# Altium project PCB_Project1.PrjPCB
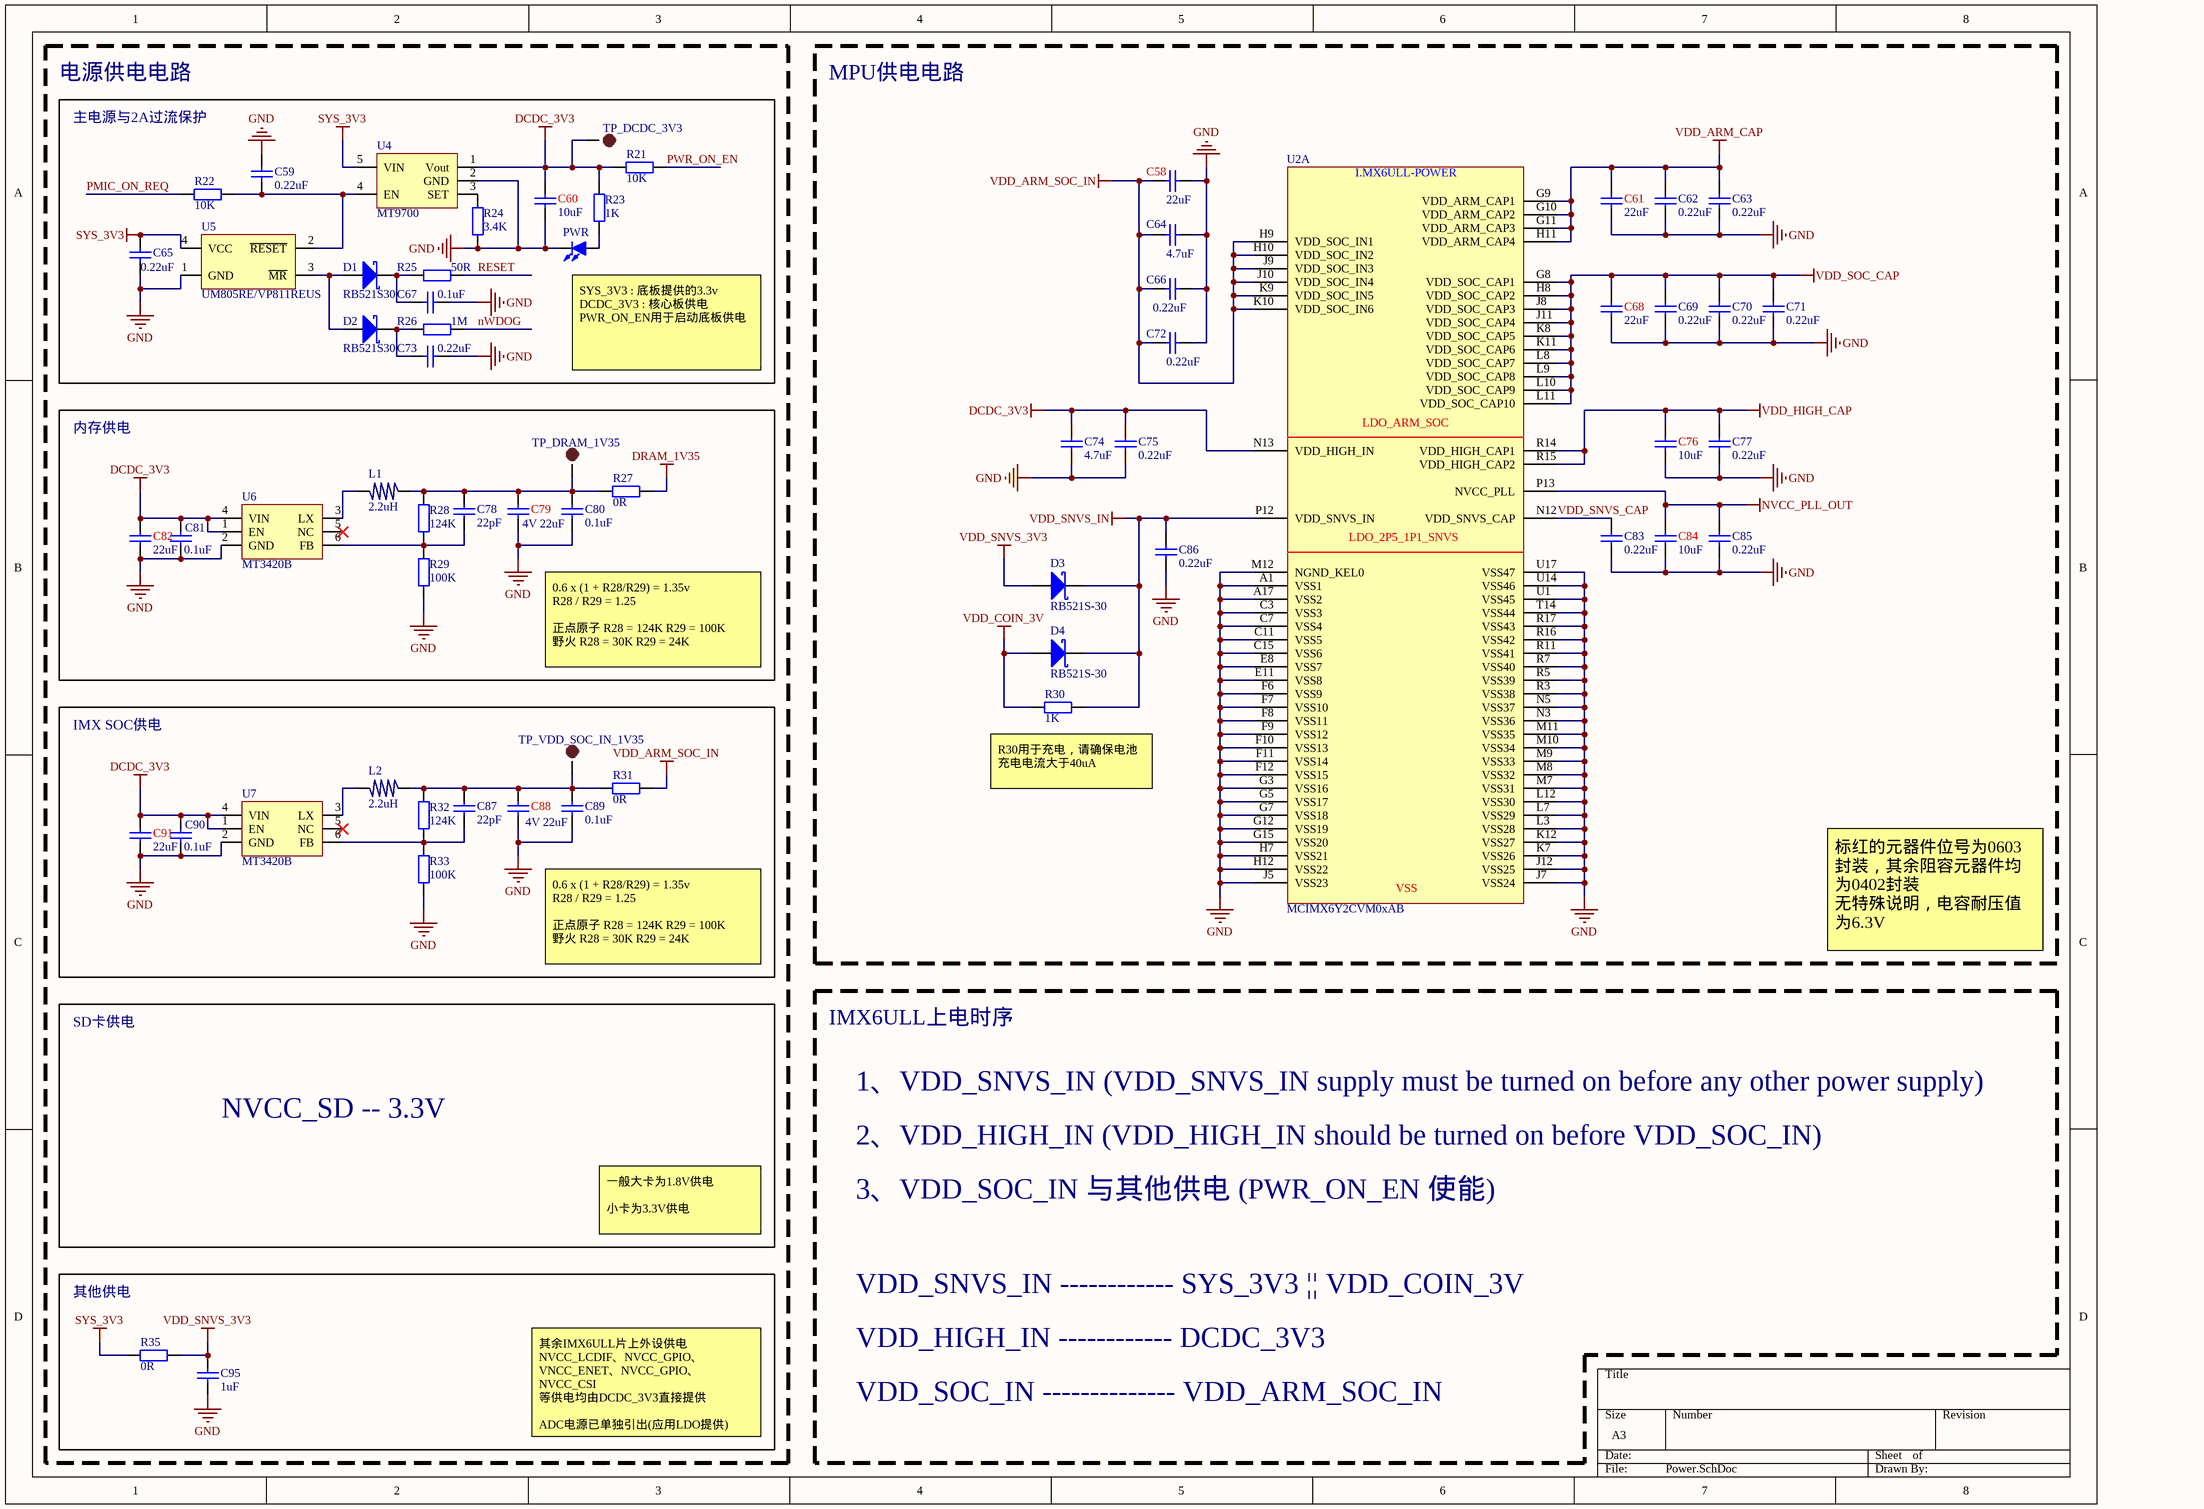
[diagram p0: Power.SchDoc]
5 sheets, 151 parts. Net scope: global (net labels, ports and power ports of the same name join across sheets).
Board file: Linux_Core_Board.PcbDoc
Sheets:
  Power.SchDoc
  Imx6ull.SchDoc
  DDR.SchDoc
  Connector.SchDoc
  eMMC.SchDoc

## Sheet Power.SchDoc
size A3; SheetNumber: 1; SheetTotal: 4

### Parts
C58  22uF  [0603_C _MINI]
C59  0.22uF  [0402_C]
C60  10uF  [0603_C _MINI]
C61  22uF  [0603_C _MINI]
C62  0.22uF  [0402_C]
C63  0.22uF  [0402_C]
C64  4.7uF  [0402_C]
C65  0.22uF  [0402_C]
C66  0.22uF  [0402_C]
C67  0.1uF  [0402_C]
C68  22uF  [0603_C _MINI]
C69  0.22uF  [0402_C]
C70  0.22uF  [0402_C]
C71  0.22uF  [0402_C]
C72  0.22uF  [0402_C]
C73  0.22uF  [0402_C]
C74  4.7uF  [0402_C]
C75  0.22uF  [0402_C]
C76  10uF  [0603_C _MINI]
C77  0.22uF  [0402_C]
C78  22pF  [0402_C]
C79  4V 22uF  [0603_C _MINI]
C80  0.1uF  [0402_C]
C81  0.1uF  [0402_C]
C82  22uF  [0603_C _MINI]
C83  0.22uF  [0402_C]
C84  10uF  [0603_C _MINI]
C85  0.22uF  [0402_C]
C86  0.22uF  [0402_C]
C87  22pF  [0402_C]
C88  4V 22uF  [0603_C _MINI]
C89  0.1uF  [0402_C]
C90  0.1uF  [0402_C]
C91  22uF  [0603_C _MINI]
C95  1uF  [0402_C]
D1  RB521S30  [SOD-523]
D2  RB521S30  [SOD-523]
D3  RB521S-30  [SOD-523]
D4  RB521S-30  [SOD-523]
L1  2.2uH  [NR3015]
L2  2.2uH  [NR3015]
PWR  (no value)  [LED 0603B]
R21  10K  [0402_R]
R22  10K  [0402_R]
R23  1K  [0402_R]
R24  3.4K  [0402_R]
R25  50R  [0402_R]
R26  1M  [0402_R]
R27  0R  [0402_R]
R28  124K  [0402_R]
R29  100K  [0402_R]
R30  1K  [0402_R]
R31  0R  [0402_R]
R32  124K  [0402_R]
R33  100K  [0402_R]
R35  0R  [0402_R]
TP_DCDC_3V3  SOC_IN  [TP-1.0]  (value not drawn)
TP_DRAM_1V35  SOC_IN  [TP-1.0]  (value not drawn)
TP_VDD_SOC_IN_1V35  SOC_IN  [TP-1.0]  (value not drawn)
U2  MCIMX6Y2CVM0xAB  [BGA289_17x17_0.8Pitch]  (part A of 5)
U4  MT9700  [SOT23-5L]
U5  UM805RE/VP811REUS  [SOT143]
U6  MT3420B  [SOT23-6L]
U7  MT3420B  [SOT23-6L]

### Blocks framed on the sheet
MPU供电电路: C58 C61-C64 C66 C68-C72 C74-C77 C83-C86 D3 D4 R30 U2
电源供电电路: C59 C60 C65 C67 C73 D1 D2 PWR R21-R26 TP_DCDC_3V3 U4 U5
内存供电: C78-C82 L1 R27-R29 TP_DRAM_1V35 U6
IMX SOC供电: C87-C91 L2 R31-R33 TP_VDD_SOC_IN_1V35 U7
其他供电: C95 R35

### Nets
DCDC_3V3: C60.2 C74.2 C75.2 C81.2 C82.2 C90.2 C91.2 R21.1 R23.2 TP_DCDC_3V3.1 U2.N13(VDD_HIGH_IN) U4.1(Vout) U6.1(EN) U6.4(VIN) U7.1(EN) U7.4(VIN)
DRAM_1V35: R27.2
GND: C58.2 C59.2 C60.1 C61.1 C62.1 C63.1 C64.2 C65.1 C66.2 C67.2 C68.1 C69.1 C70.1 C71.1 C72.2 C73.2 C74.1 C75.1 C76.1 C77.1 C79.1 C80.1 C81.1 C82.1 C83.1 C84.1 C85.1 C86.1 C88.1 C89.1 C90.1 C91.1 C95.1 PWR.2(K) R24.2 R29.1 R33.1 U2.A1(VSS1) U2.A17(VSS2) U2.C3(VSS3) U2.C7(VSS4) U2.C11(VSS5) U2.C15(VSS6) U2.E8(VSS7) U2.E11(VSS8) U2.F6(VSS9) U2.F7(VSS10) U2.F8(VSS11) U2.F9(VSS12) U2.F10(VSS13) U2.F11(VSS14) U2.F12(VSS15) U2.G3(VSS16) U2.G5(VSS17) U2.G7(VSS18) U2.G12(VSS19) U2.G15(VSS20) U2.H7(VSS21) U2.H12(VSS22) U2.J5(VSS23) U2.J7(VSS24) U2.J12(VSS25) U2.K7(VSS26) U2.K12(VSS27) U2.L3(VSS28) U2.L7(VSS29) U2.L12(VSS30) U2.M7(VSS31) U2.M8(VSS32) U2.M9(VSS33) U2.M10(VSS34) U2.M11(VSS35) U2.M12(NGND_KEL0) U2.N3(VSS36) U2.N5(VSS37) U2.R3(VSS38) U2.R5(VSS39) U2.R7(VSS40) U2.R11(VSS41) U2.R16(VSS42) U2.R17(VSS43) U2.T14(VSS44) U2.U1(VSS45) U2.U14(VSS46) U2.U17(VSS47) U4.2(GND) U5.1(GND) U6.2(GND) U7.2(GND)
NVCC_PLL_OUT: C84.2 C85.2 U2.P13(NVCC_PLL)
SYS_3V3: C65.2 R35.1 U4.5(VIN) U5.4(VCC)
VDD_ARM_CAP: C61.2 C62.2 C63.2 U2.G9(VDD_ARM_CAP1) U2.G10(VDD_ARM_CAP2) U2.G11(VDD_ARM_CAP3) U2.H11(VDD_ARM_CAP4)
VDD_ARM_SOC_IN: C58.1 C64.1 C66.1 C72.1 R31.2 U2.H9(VDD_SOC_IN1) U2.H10(VDD_SOC_IN2) U2.J9(VDD_SOC_IN3) U2.J10(VDD_SOC_IN4) U2.K9(VDD_SOC_IN5) U2.K10(VDD_SOC_IN6)
VDD_COIN_3V: D4.1(A) R30.1
VDD_HIGH_CAP: C76.2 C77.2 U2.R14(VDD_HIGH_CAP1) U2.R15(VDD_HIGH_CAP2)
VDD_SNVS_3V3: C95.2 D3.1(A) R35.2
VDD_SNVS_IN: C86.2 D3.2(C) D4.2(C) R30.2 U2.P12(VDD_SNVS_IN)
VDD_SOC_CAP: C68.2 C69.2 C70.2 C71.2 U2.G8(VDD_SOC_CAP1) U2.H8(VDD_SOC_CAP2) U2.J8(VDD_SOC_CAP3) U2.J11(VDD_SOC_CAP4) U2.K8(VDD_SOC_CAP5) U2.K11(VDD_SOC_CAP6) U2.L8(VDD_SOC_CAP7) U2.L9(VDD_SOC_CAP8) U2.L10(VDD_SOC_CAP9) U2.L11(VDD_SOC_CAP10)
nWDOG: R26.2
PMIC_ON_REQ: R22.1
PWR_ON_EN: R21.2
RESET: R25.2
VDD_SNVS_CAP: C83.2 U2.N12(VDD_SNVS_CAP)
NetC59_1: C59.1 R22.2 U4.4(EN) U5.2(~{RESET})
NetC67_1: C67.1 D1.2(C) R25.1
NetC73_1: C73.1 D2.2(C) R26.1
NetC78_1: C78.1 R28.1 R29.2 U6.6(FB)
NetC78_2: C78.2 C79.2 C80.2 L1.1 R27.1 R28.2 TP_DRAM_1V35.1
NetC87_1: C87.1 R32.1 R33.2 U7.6(FB)
NetC87_2: C87.2 C88.2 C89.2 L2.1 R31.1 R32.2 TP_VDD_SOC_IN_1V35.1
NetD1_1: D1.1(A) D2.1(A) U5.3(~{MR})
NetL1_2: L1.2 U6.3(LX)
NetL2_2: L2.2 U7.3(LX)
NetPWR_1: PWR.1(A) R23.1
NetR24_1: R24.1 U4.3(SET)

Not connected (* = marked no-connect by the designer): U6 5(NC)*; U7 5(NC)*

### Notes on the sheet
- 主电源与2A过流保护
- (near PWR) SYS_3V3 : 底板提供的3.3v
  DCDC_3V3 : 核心板供电
  PWR_ON_EN用于启动底板供电
- 0.6 x (1 + R28/R29) = 1.35v
  R28 / R29 = 1.25
  正点原子 R28 = 124K R29 = 100K
  野火 R28 = 30K R29 = 24K
- (near R30) R30用于充电，请确保电池充电电流大于40uA
- 标红的元器件位号为0603封装，其余阻容元器件均为0402封装
  无特殊说明，电容耐压值为6.3V
- SD卡供电
- IMX6ULL上电时序
- NVCC_SD -- 3.3V
- 1、VDD_SNVS_IN (VDD_SNVS_IN supply must be turned on before any other power supply)
- 2、VDD_HIGH_IN (VDD_HIGH_IN should be turned on before VDD_SOC_IN)
- 一般大卡为1.8V供电
  小卡为3.3V供电
- 3、VDD_SOC_IN 与其他供电 (PWR_ON_EN 使能)
- VDD_SNVS_IN ------------ SYS_3V3 || VDD_COIN_3V
- VDD_HIGH_IN ------------ DCDC_3V3
- 其余IMX6ULL片上外设供电
  NVCC_LCDIF、NVCC_GPIO、
  VNCC_ENET、NVCC_GPIO、
  NVCC_CSI
  等供电均由DCDC_3V3直接提供
  ADC电源已单独引出(应用LDO提供)
- VDD_SOC_IN -------------- VDD_ARM_SOC_IN
- (in symbol MCIMX6Y2CVM0xAB, part A) I.MX6ULL-POWER; LDO_ARM_SOC; LDO_2P5_1P1_SNVS; VSS

### Library data of the parts
C58 C60 C61 C68 C76 C79 C82 C84 C88 C91 = 0603_C_MINI: 贴片电容; ComponentLink1Description: 供应商链接; ComponentLink1URL: http://www.szlcsc.com/product/details_2037.html; Package: 0603; Supplier: LC; SuppliersPartNumber: C1685
C59 C62-C67 C69-C75 C77 C78 C80 C81 C83 C85-C87 C89 C90 C95 = 0402_C: 贴片电容; ComponentLink1Description: 供应商链接; ComponentLink1URL: http://www.szlcsc.com/product/details_1928.html; Package: 0402; Supplier: LC; SuppliersPartNumber: C1576
D3 D4 = RB521S30
L1 L2 = L
PWR = 0603_LED_B: 贴片LED; 版权归属: 源创客; BOM名称: 贴片LED; 学习资源: www.ooocke.com
R21-R33 R35 = 0402_R: 贴片电阻; ComponentLink1Description: 供应商链接; ComponentLink1URL: http://www.szlcsc.com/product/details_26667.html; Package: 0402; Supplier: LC; SuppliersPartNumber: C25924
TP_DCDC_3V3 TP_DRAM_1V35 TP_VDD_SOC_IN_1V35 = TEST-POINT: 测试点
U4 = MT9700: 负载开关
U5 = UM805RE/VP811REUS: 复位芯片
U6 U7 = MT3420B: DCDC

## Sheet Imx6ull.SchDoc
size 299 x 312 mm; SheetNumber: 3; SheetTotal: 4
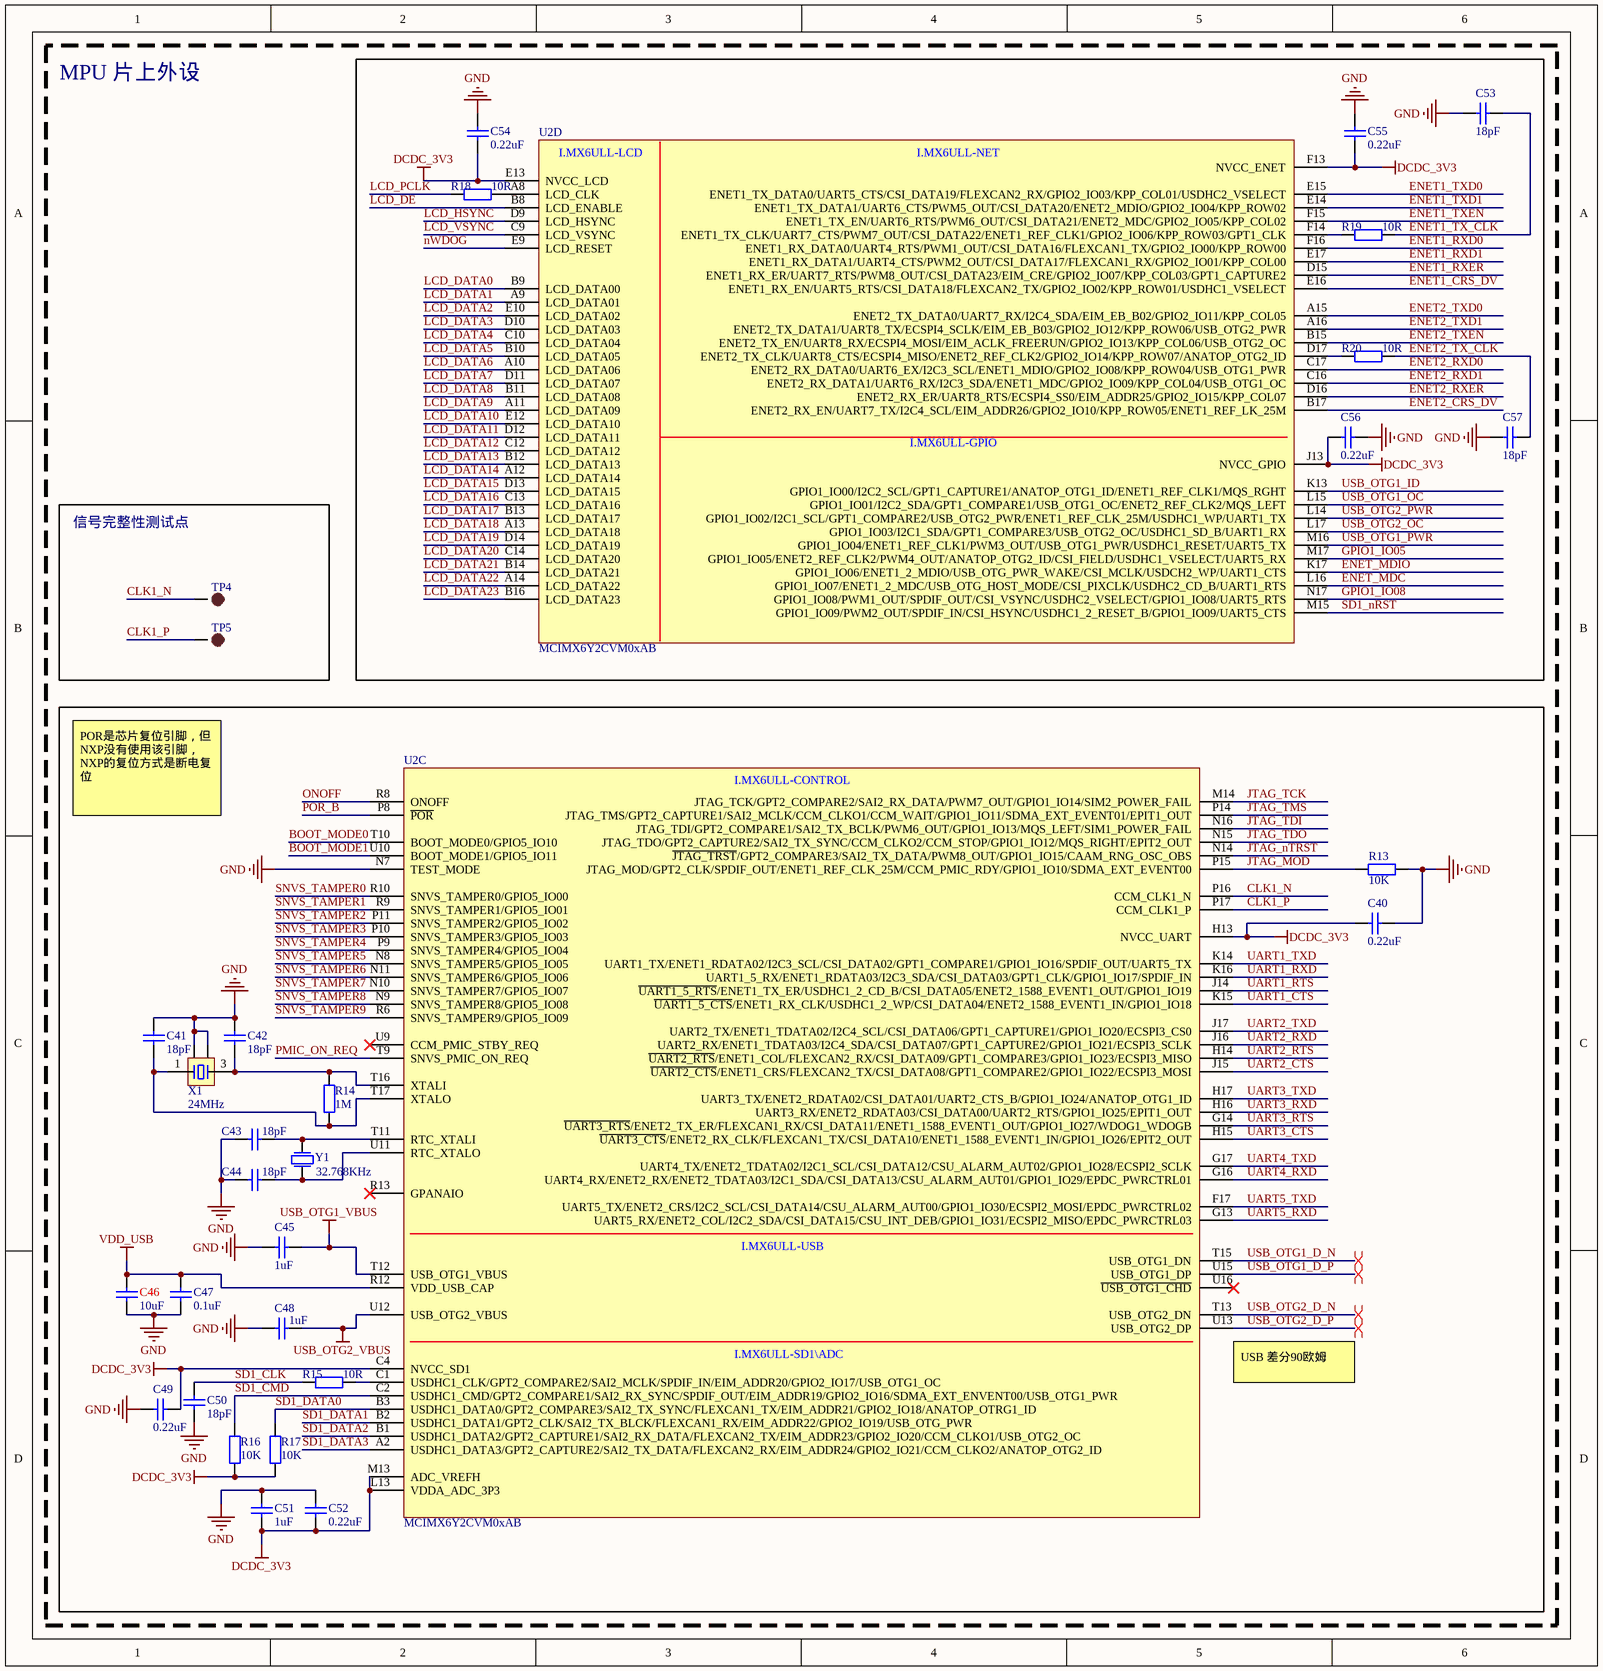
[diagram p1: Imx6ull.SchDoc]

### Parts
C40  0.22uF  [0402_C]
C41  18pF  [0402_C]
C42  18pF  [0402_C]
C43  18pF  [0402_C]
C44  18pF  [0402_C]
C45  1uF  [0402_C]
C46  10uF  [0603_C _MINI]
C47  0.1uF  [0402_C]
C48  1uF  [0402_C]
C49  0.22uF  [0402_C]
C50  18pF  [0402_C]
C51  1uF  [0402_C]
C52  0.22uF  [0402_C]
C53  18pF  [0402_C]
C54  0.22uF  [0402_C]
C55  0.22uF  [0402_C]
C56  0.22uF  [0402_C]
C57  18pF  [0402_C]
R13  10K  [0402_R]
R14  1M  [0402_R]
R15  10R  [0402_R]
R16  10K  [0402_R]
R17  10K  [0402_R]
R18  10R  [0402_R]
R19  10R  [0402_R]
R20  10R  [0402_R]
TP4  SOC_IN  [TP-1.0]  (value not drawn)
TP5  SOC_IN  [TP-1.0]  (value not drawn)
U2  MCIMX6Y2CVM0xAB  [BGA289_17x17_0.8Pitch]  (parts C,D of 5)
X1  24MHz  [OSC 3225-4P]
Y1  32.768KHz  [OSC 3215-2P]

### Blocks framed on the sheet
信号完整性测试点: TP4 TP5

### Nets
DCDC_3V3: C40.1 C49.2 C51.1 C52.1 C54.1 C55.1 C56.1 R16.1 R17.1 U2.C4(NVCC_SD1) U2.E13(NVCC_LCD) U2.F13(NVCC_ENET) U2.H13(NVCC_UART) U2.J13(NVCC_GPIO) U2.L13(VDDA_ADC_3P3) U2.M13(ADC_VREFH)
GND: C40.2 C41.2 C42.2 C43.1 C44.1 C45.1 C46.1 C47.1 C48.1 C49.1 C50.1 C51.2 C52.2 C53.2 C54.2 C55.2 C56.2 C57.1 R13.2 U2.N7(TEST_MODE) X1.2 X1.4
USB_OTG1_VBUS: C45.2 U2.T12(USB_OTG1_VBUS)
USB_OTG2_VBUS: C48.2 U2.U12(USB_OTG2_VBUS)
VDD_USB: C46.2 C47.2 U2.R12(VDD_USB_CAP)
BOOT_MODE0: U2.T10(BOOT_MODE0/GPIO5_IO10)
BOOT_MODE1: U2.U10(BOOT_MODE1/GPIO5_IO11)
CLK1_N: TP4.1 U2.P16(CCM_CLK1_N)
CLK1_P: TP5.1 U2.P17(CCM_CLK1_P)
ENET1_CRS_DV: U2.E16(ENET1_RX_EN/UART5_RTS/CSI_DATA18/FLEXCAN2_TX/GPIO2_IO02/KPP_ROW01/USDHC1_VSELECT)
ENET1_RXD0: U2.F16(ENET1_RX_DATA0/UART4_RTS/PWM1_OUT/CSI_DATA16/FLEXCAN1_TX/GPIO2_IO00/KPP_ROW00)
ENET1_RXD1: U2.E17(ENET1_RX_DATA1/UART4_CTS/PWM2_OUT/CSI_DATA17/FLEXCAN1_RX/GPIO2_IO01/KPP_COL00)
ENET1_RXER: U2.D15(ENET1_RX_ER/UART7_RTS/PWM8_OUT/CSI_DATA23/EIM_CRE/GPIO2_IO07/KPP_COL03/GPT1_CAPTURE2)
ENET1_TX_CLK: C53.1 R19.2
ENET1_TXD0: U2.E15(ENET1_TX_DATA0/UART5_CTS/CSI_DATA19/FLEXCAN2_RX/GPIO2_IO03/KPP_COL01/USDHC2_VSELECT)
ENET1_TXD1: U2.E14(ENET1_TX_DATA1/UART6_CTS/PWM5_OUT/CSI_DATA20/ENET2_MDIO/GPIO2_IO04/KPP_ROW02)
ENET1_TXEN: U2.F15(ENET1_TX_EN/UART6_RTS/PWM6_OUT/CSI_DATA21/ENET2_MDC/GPIO2_IO05/KPP_COL02)
ENET2_CRS_DV: U2.B17(ENET2_RX_EN/UART7_TX/I2C4_SCL/EIM_ADDR26/GPIO2_IO10/KPP_ROW05/ENET1_REF_LK_25M)
ENET2_RXD0: U2.C17(ENET2_RX_DATA0/UART6_EX/I2C3_SCL/ENET1_MDIO/GPIO2_IO08/KPP_ROW04/USB_OTG1_PWR)
ENET2_RXD1: U2.C16(ENET2_RX_DATA1/UART6_RX/I2C3_SDA/ENET1_MDC/GPIO2_IO09/KPP_COL04/USB_OTG1_OC)
ENET2_RXER: U2.D16(ENET2_RX_ER/UART8_RTS/ECSPI4_SS0/EIM_ADDR25/GPIO2_IO15/KPP_COL07)
ENET2_TX_CLK: C57.2 R20.2
ENET2_TXD0: U2.A15(ENET2_TX_DATA0/UART7_RX/I2C4_SDA/EIM_EB_B02/GPIO2_IO11/KPP_COL05)
ENET2_TXD1: U2.A16(ENET2_TX_DATA1/UART8_TX/ECSPI4_SCLK/EIM_EB_B03/GPIO2_IO12/KPP_ROW06/USB_OTG2_PWR)
ENET2_TXEN: U2.B15(ENET2_TX_EN/UART8_RX/ECSPI4_MOSI/EIM_ACLK_FREERUN/GPIO2_IO13/KPP_COL06/USB_OTG2_OC)
ENET_MDC: U2.L16(GPIO1_IO07/ENET1_2_MDC/USB_OTG_HOST_MODE/CSI_PIXCLK/USDHC2_CD_B/UART1_RTS)
ENET_MDIO: U2.K17(GPIO1_IO06/ENET1_2_MDIO/USB_OTG_PWR_WAKE/CSI_MCLK/USDCH2_WP/UART1_CTS)
GPIO1_IO05: U2.M17(GPIO1_IO05/ENET2_REF_CLK2/PWM4_OUT/ANATOP_OTG2_ID/CSI_FIELD/USDHC1_VSELECT/UART5_RX)
GPIO1_IO08: U2.N17(GPIO1_IO08/PWM1_OUT/SPDIF_OUT/CSI_VSYNC/USDHC2_VSELECT/GPIO1_IO08/UART5_RTS)
JTAG_MOD: R13.1 U2.P15(JTAG_MOD/GPT2_CLK/SPDIF_OUT/ENET1_REF_CLK_25M/CCM_PMIC_RDY/GPIO1_IO10/SDMA_EXT_EVENT00)
JTAG_nTRST: U2.N14(~{JTAG_TRST}/GPT2_COMPARE3/SAI2_TX_DATA/PWM8_OUT/GPIO1_IO15/CAAM_RNG_OSC_OBS)
JTAG_TCK: U2.M14(JTAG_TCK/GPT2_COMPARE2/SAI2_RX_DATA/PWM7_OUT/GPIO1_IO14/SIM2_POWER_FAIL)
JTAG_TDI: U2.N16(JTAG_TDI/GPT2_COMPARE1/SAI2_TX_BCLK/PWM6_OUT/GPIO1_IO13/MQS_LEFT/SIM1_POWER_FAIL)
JTAG_TDO: U2.N15(JTAG_TDO/GPT2_CAPTURE2/SAI2_TX_SYNC/CCM_CLKO2/CCM_STOP/GPIO1_IO12/MQS_RIGHT/EPIT2_OUT)
JTAG_TMS: U2.P14(JTAG_TMS/GPT2_CAPTURE1/SAI2_MCLK/CCM_CLKO1/CCM_WAIT/GPIO1_IO11/SDMA_EXT_EVENT01/EPIT1_OUT)
LCD_DATA0: U2.B9(LCD_DATA00)
LCD_DATA1: U2.A9(LCD_DATA01)
LCD_DATA2: U2.E10(LCD_DATA02)
LCD_DATA3: U2.D10(LCD_DATA03)
LCD_DATA4: U2.C10(LCD_DATA04)
LCD_DATA5: U2.B10(LCD_DATA05)
LCD_DATA6: U2.A10(LCD_DATA06)
LCD_DATA7: U2.D11(LCD_DATA07)
LCD_DATA8: U2.B11(LCD_DATA08)
LCD_DATA9: U2.A11(LCD_DATA09)
LCD_DATA10: U2.E12(LCD_DATA10)
LCD_DATA11: U2.D12(LCD_DATA11)
LCD_DATA12: U2.C12(LCD_DATA12)
LCD_DATA13: U2.B12(LCD_DATA13)
LCD_DATA14: U2.A12(LCD_DATA14)
LCD_DATA15: U2.D13(LCD_DATA15)
LCD_DATA16: U2.C13(LCD_DATA16)
LCD_DATA17: U2.B13(LCD_DATA17)
LCD_DATA18: U2.A13(LCD_DATA18)
LCD_DATA19: U2.D14(LCD_DATA19)
LCD_DATA20: U2.C14(LCD_DATA20)
LCD_DATA21: U2.B14(LCD_DATA21)
LCD_DATA22: U2.A14(LCD_DATA22)
LCD_DATA23: U2.B16(LCD_DATA23)
LCD_DE: U2.B8(LCD_ENABLE)
LCD_HSYNC: U2.D9(LCD_HSYNC)
LCD_PCLK: R18.1
LCD_VSYNC: U2.C9(LCD_VSYNC)
nWDOG: U2.E9(LCD_RESET)
ONOFF: U2.R8(ONOFF)
PMIC_ON_REQ: U2.T9(SNVS_PMIC_ON_REQ)
POR_B: U2.P8(~{POR})
SD1_CLK: C50.2 R15.1
SD1_CMD: R16.2 U2.C2(USDHC1_CMD/GPT2_COMPARE1/SAI2_RX_SYNC/SPDIF_OUT/EIM_ADDR19/GPIO2_IO16/SDMA_EXT_ENVENT00/USB_OTG1_PWR)
SD1_DATA0: R17.2 U2.B3(USDHC1_DATA0/GPT2_COMPARE3/SAI2_TX_SYNC/FLEXCAN1_TX/EIM_ADDR21/GPIO2_IO18/ANATOP_OTRG1_ID)
SD1_DATA1: U2.B2(USDHC1_DATA1/GPT2_CLK/SAI2_TX_BLCK/FLEXCAN1_RX/EIM_ADDR22/GPIO2_IO19/USB_OTG_PWR)
SD1_DATA2: U2.B1(USDHC1_DATA2/GPT2_CAPTURE1/SAI2_RX_DATA/FLEXCAN2_TX/EIM_ADDR23/GPIO2_IO20/CCM_CLKO1/USB_OTG2_OC)
SD1_DATA3: U2.A2(USDHC1_DATA3/GPT2_CAPTURE2/SAI2_TX_DATA/FLEXCAN2_RX/EIM_ADDR24/GPIO2_IO21/CCM_CLKO2/ANATOP_OTG2_ID)
SD1_nRST: U2.M15(GPIO1_IO09/PWM2_OUT/SPDIF_IN/CSI_HSYNC/USDHC1_2_RESET_B/GPIO1_IO09/UART5_CTS)
SNVS_TAMPER0: U2.R10(SNVS_TAMPER0/GPIO5_IO00)
SNVS_TAMPER1: U2.R9(SNVS_TAMPER1/GPIO5_IO01)
SNVS_TAMPER2: U2.P11(SNVS_TAMPER2/GPIO5_IO02)
SNVS_TAMPER3: U2.P10(SNVS_TAMPER3/GPIO5_IO03)
SNVS_TAMPER4: U2.P9(SNVS_TAMPER4/GPIO5_IO04)
SNVS_TAMPER5: U2.N8(SNVS_TAMPER5/GPIO5_IO05)
SNVS_TAMPER6: U2.N11(SNVS_TAMPER6/GPIO5_IO06)
SNVS_TAMPER7: U2.N10(SNVS_TAMPER7/GPIO5_IO07)
SNVS_TAMPER8: U2.N9(SNVS_TAMPER8/GPIO5_IO08)
SNVS_TAMPER9: U2.R6(SNVS_TAMPER9/GPIO5_IO09)
UART1_CTS: U2.K15(~{UART1_5_CTS}/ENET1_RX_CLK/USDHC1_2_WP/CSI_DATA04/ENET2_1588_EVENT1_IN/GPIO1_IO18)
UART1_RTS: U2.J14(~{UART1_5_}~{RTS}/ENET1_TX_ER/USDHC1_2_CD_B/CSI_DATA05/ENET2_1588_EVENT1_OUT/GPIO1_IO19)
UART1_RXD: U2.K16(UART1_5_RX/ENET1_RDATA03/I2C3_SDA/CSI_DATA03/GPT1_CLK/GPIO1_IO17/SPDIF_IN)
UART1_TXD: U2.K14(UART1_TX/ENET1_RDATA02/I2C3_SCL/CSI_DATA02/GPT1_COMPARE1/GPIO1_IO16/SPDIF_OUT/UART5_TX)
UART2_CTS: U2.J15(~{UART2_CTS}/ENET1_CRS/FLEXCAN2_TX/CSI_DATA08/GPT1_COMPARE2/GPIO1_IO22/ECSPI3_MOSI)
UART2_RTS: U2.H14(~{UART2_RTS}/ENET1_COL/FLEXCAN2_RX/CSI_DATA09/GPT1_COMPARE3/GPIO1_IO23/ECSPI3_MISO)
UART2_RXD: U2.J16(UART2_RX/ENET1_TDATA03/I2C4_SDA/CSI_DATA07/GPT1_CAPTURE2/GPIO1_IO21/ECSPI3_SCLK)
UART2_TXD: U2.J17(UART2_TX/ENET1_TDATA02/I2C4_SCL/CSI_DATA06/GPT1_CAPTURE1/GPIO1_IO20/ECSPI3_CS0)
UART3_CTS: U2.H15(~{UART3_CTS}/ENET2_RX_CLK/FLEXCAN1_TX/CSI_DATA10/ENET1_1588_EVENT1_IN/GPIO1_IO26/EPIT2_OUT)
UART3_RTS: U2.G14(~{UART3_RTS}/ENET2_TX_ER/FLEXCAN1_RX/CSI_DATA11/ENET1_1588_EVENT1_OUT/GPIO1_IO27/WDOG1_WDOGB)
UART3_RXD: U2.H16(UART3_RX/ENET2_RDATA03/CSI_DATA00/UART2_RTS/GPIO1_IO25/EPIT1_OUT)
UART3_TXD: U2.H17(UART3_TX/ENET2_RDATA02/CSI_DATA01/UART2_CTS_B/GPIO1_IO24/ANATOP_OTG1_ID)
UART4_RXD: U2.G16(UART4_RX/ENET2_RX/ENET2_TDATA03/I2C1_SDA/CSI_DATA13/CSU_ALARM_AUT01/GPIO1_IO29/EPDC_PWRCTRL01)
UART4_TXD: U2.G17(UART4_TX/ENET2_TDATA02/I2C1_SCL/CSI_DATA12/CSU_ALARM_AUT02/GPIO1_IO28/ECSPI2_SCLK)
UART5_RXD: U2.G13(UART5_RX/ENET2_COL/I2C2_SDA/CSI_DATA15/CSU_INT_DEB/GPIO1_IO31/ECSPI2_MISO/EPDC_PWRCTRL03)
UART5_TXD: U2.F17(UART5_TX/ENET2_CRS/I2C2_SCL/CSI_DATA14/CSU_ALARM_AUT00/GPIO1_IO30/ECSPI2_MOSI/EPDC_PWRCTRL02)
USB_OTG1_D_N: U2.T15(USB_OTG1_DN)
USB_OTG1_D_P: U2.U15(USB_OTG1_DP)
USB_OTG1_ID: U2.K13(GPIO1_IO00/I2C2_SCL/GPT1_CAPTURE1/ANATOP_OTG1_ID/ENET1_REF_CLK1/MQS_RGHT)
USB_OTG1_OC: U2.L15(GPIO1_IO01/I2C2_SDA/GPT1_COMPARE1/USB_OTG1_OC/ENET2_REF_CLK2/MQS_LEFT)
USB_OTG1_PWR: U2.M16(GPIO1_IO04/ENET1_REF_CLK1/PWM3_OUT/USB_OTG1_PWR/USDHC1_RESET/UART5_TX)
USB_OTG2_D_N: U2.T13(USB_OTG2_DN)
USB_OTG2_D_P: U2.U13(USB_OTG2_DP)
USB_OTG2_OC: U2.L17(GPIO1_IO03/I2C1_SDA/GPT1_COMPARE3/USB_OTG2_OC/USDHC1_SD_B/UART1_RX)
USB_OTG2_PWR: U2.L14(GPIO1_IO02/I2C1_SCL/GPT1_COMPARE2/USB_OTG2_PWR/ENET1_REF_CLK_25M/USDHC1_WP/UART1_TX)
NetC41_1: C41.1 R14.2 U2.T17(XTALO) X1.1
NetC42_1: C42.1 R14.1 U2.T16(XTALI) X1.3
NetC43_2: C43.2 U2.T11(RTC_XTALI) Y1.2(P2)
NetC44_2: C44.2 U2.U11(RTC_XTALO) Y1.1(P1)
NetR15_2: R15.2 U2.C1(USDHC1_CLK/GPT2_COMPARE2/SAI2_MCLK/SPDIF_IN/EIM_ADDR20/GPIO2_IO17/USB_OTG1_OC)
NetR18_2: R18.2 U2.A8(LCD_CLK)
NetR19_1: R19.1 U2.F14(ENET1_TX_CLK/UART7_CTS/PWM7_OUT/CSI_DATA22/ENET1_REF_CLK1/GPIO2_IO06/KPP_ROW03/GPT1_CLK)
NetR20_1: R20.1 U2.D17(ENET2_TX_CLK/UART8_CTS/ECSPI4_MISO/ENET2_REF_CLK2/GPIO2_IO14/KPP_ROW07/ANATOP_OTG2_ID)

Not connected (* = marked no-connect by the designer): U2 R13(GPANAIO)* U9(CCM_PMIC_STBY_REQ)* U16(~{USB_OTG1_CHD})*

### Layout directives
differential pair: USB_OTG1_D_N, USB_OTG1_D_P, USB_OTG2_D_N, USB_OTG2_D_P

### Notes on the sheet
- MPU 片上外设
- POR是芯片复位引脚，但NXP没有使用该引脚，NXP的复位方式是断电复位
- (near U2) USB 差分90欧姆
- (in symbol MCIMX6Y2CVM0xAB, part C) I.MX6ULL-CONTROL; I.MX6ULL-USB; I.MX6ULL-SD1\ADC
- (in symbol MCIMX6Y2CVM0xAB, part D) I.MX6ULL-LCD; I.MX6ULL-NET; I.MX6ULL-GPIO

### Library data of the parts
C40-C45 C47-C57 = 0402_C: 贴片电容; ComponentLink1Description: 供应商链接; ComponentLink1URL: http://www.szlcsc.com/product/details_1928.html; Package: 0402; Supplier: LC; SuppliersPartNumber: C1576
C46 = 0603_C_MINI: 贴片电容; ComponentLink1Description: 供应商链接; ComponentLink1URL: http://www.szlcsc.com/product/details_2037.html; Package: 0603; Supplier: LC; SuppliersPartNumber: C1685
R13-R20 = 0402_R: 贴片电阻; ComponentLink1Description: 供应商链接; ComponentLink1URL: http://www.szlcsc.com/product/details_26667.html; Package: 0402; Supplier: LC; SuppliersPartNumber: C25924
TP4 TP5 = TEST-POINT: 测试点
X1 = XTAL-4P: 4脚无源晶振; 版权归属: 源创客; BOM名称: 4脚无源晶振; 学习资源: www.ooocke.com
Y1 = XTAL-2P: 2脚无源晶振; ComponentLink1Description: 供应商链接; ComponentLink1URL: http://www.szlcsc.com/product/details_33310.html; Package: SMD-3215_2P; Supplier: LC; SuppliersPartNumber: C32346

## Sheet DDR.SchDoc
size 294 x 241 mm; SheetNumber: 2; SheetTotal: 4
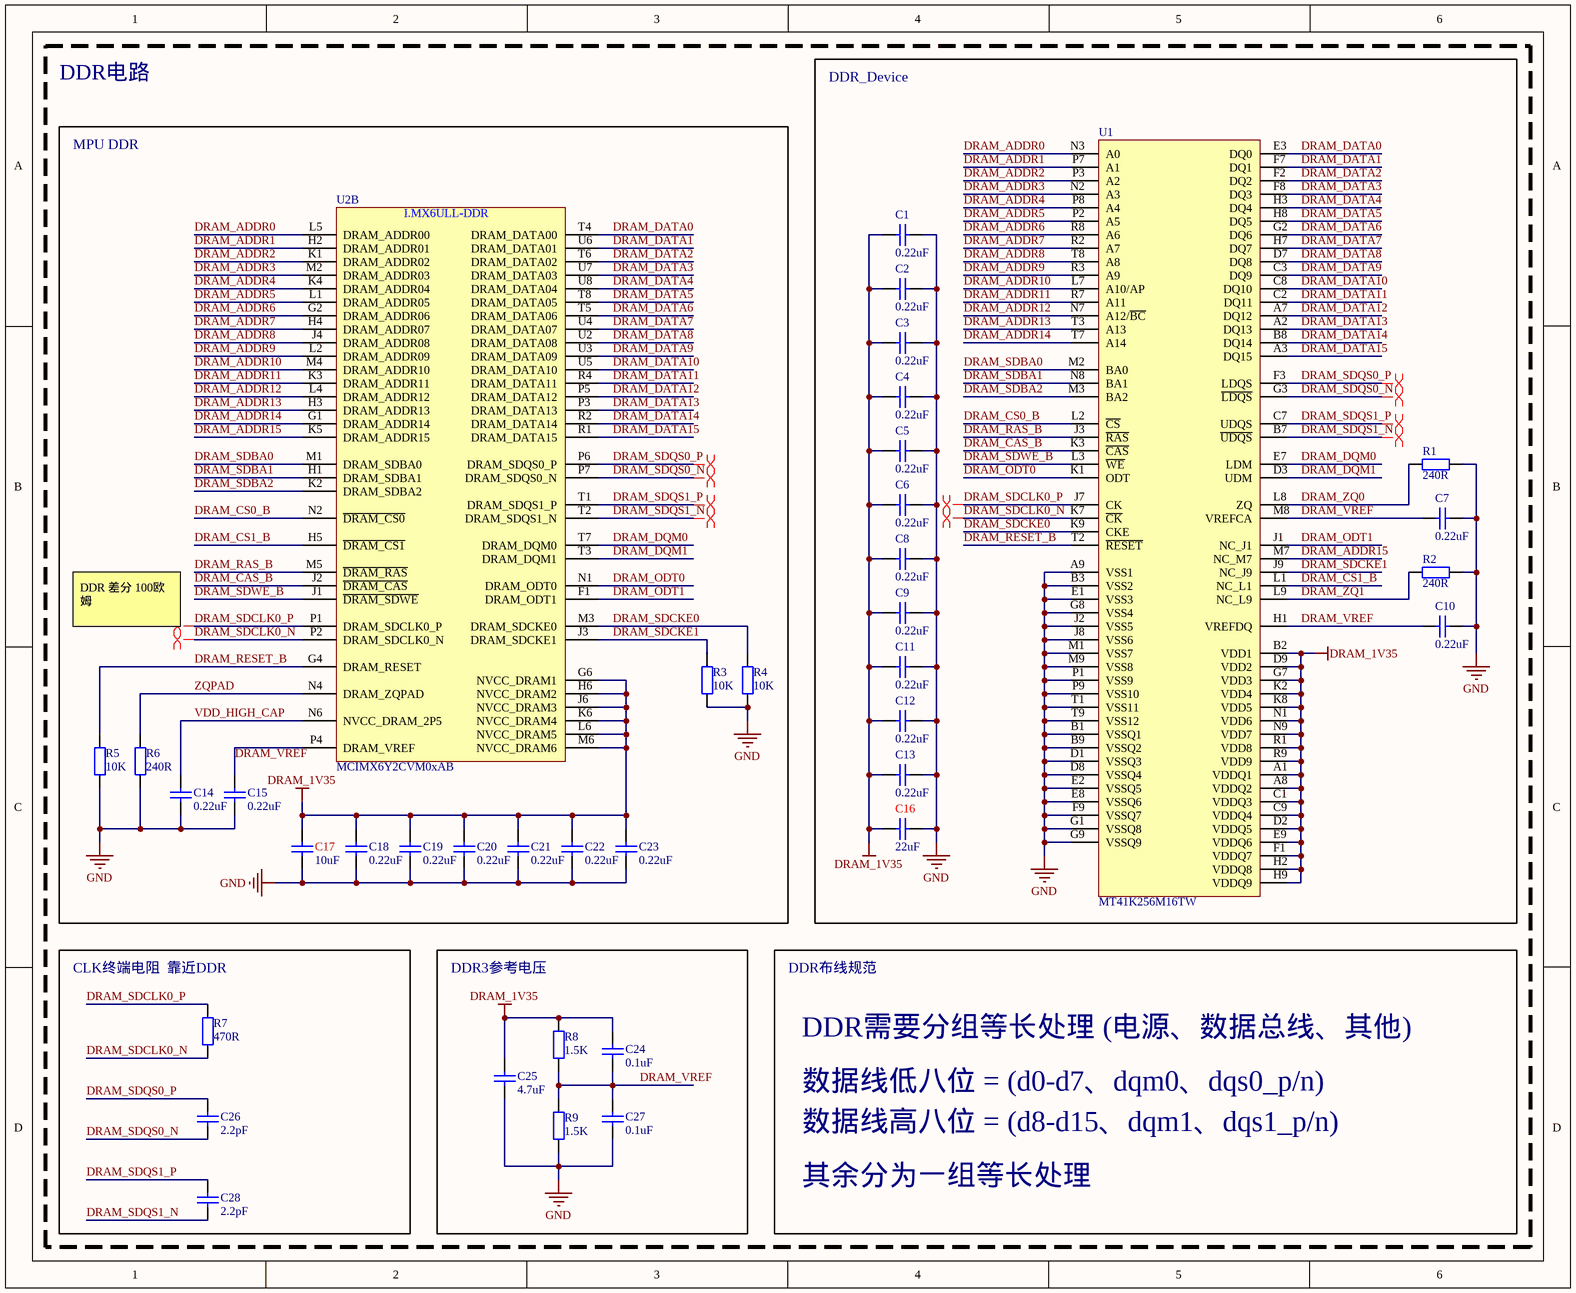
[diagram p2: DDR.SchDoc]

### Parts
C1  0.22uF  [0402_C]
C2  0.22uF  [0402_C]
C3  0.22uF  [0402_C]
C4  0.22uF  [0402_C]
C5  0.22uF  [0402_C]
C6  0.22uF  [0402_C]
C7  0.22uF  [0402_C]
C8  0.22uF  [0402_C]
C9  0.22uF  [0402_C]
C10  0.22uF  [0402_C]
C11  0.22uF  [0402_C]
C12  0.22uF  [0402_C]
C13  0.22uF  [0402_C]
C14  0.22uF  [0402_C]
C15  0.22uF  [0402_C]
C16  22uF  [0603_C _MINI]
C17  10uF  [0603_C _MINI]
C18  0.22uF  [0402_C]
C19  0.22uF  [0402_C]
C20  0.22uF  [0402_C]
C21  0.22uF  [0402_C]
C22  0.22uF  [0402_C]
C23  0.22uF  [0402_C]
C24  0.1uF  [0402_C]
C25  4.7uF  [0402_C]
C26  2.2pF  [0402_C]
C27  0.1uF  [0402_C]
C28  2.2pF  [0402_C]
R1  240R  [0402_R]
R2  240R  [0402_R]
R3  10K  [0402_R]
R4  10K  [0402_R]
R5  10K  [0402_R]
R6  240R  [0402_R]
R7  470R  [0402_R]
R8  1.5K  [0402_R]
R9  1.5K  [0402_R]
U1  MT41K256M16TW  [BGA96]
U2  MCIMX6Y2CVM0xAB  [BGA289_17x17_0.8Pitch]  (part B of 5)

### Blocks framed on the sheet
DDR_Device: C1-C13 C16 R1 R2 U1
MPU DDR: C14 C15 C17-C23 R3-R6 U2
CLK终端电阻  靠近DDR: C26 C28 R7
DDR3参考电压: C24 C25 C27 R8 R9

### Nets
DRAM_1V35: C1.2 C2.2 C3.2 C4.2 C5.2 C6.2 C8.2 C9.2 C11.2 C12.2 C13.2 C16.1 C17.2 C18.2 C19.2 C20.2 C21.2 C22.2 C23.2 C24.2 C25.2 R8.2 U1.A1(VDDQ1) U1.A8(VDDQ2) U1.B2(VDD1) U1.C1(VDDQ3) U1.C9(VDDQ4) U1.D2(VDDQ5) U1.D9(VDD2) U1.E9(VDDQ6) U1.F1(VDDQ7) U1.G7(VDD3) U1.H2(VDDQ8) U1.H9(VDDQ9) U1.K2(VDD4) U1.K8(VDD5) U1.N1(VDD6) U1.N9(VDD7) U1.R1(VDD8) U1.R9(VDD9) U2.G6(NVCC_DRAM1) U2.H6(NVCC_DRAM2) U2.J6(NVCC_DRAM3) U2.K6(NVCC_DRAM4) U2.L6(NVCC_DRAM5) U2.M6(NVCC_DRAM6)
GND: C1.1 C2.1 C3.1 C4.1 C5.1 C6.1 C7.2 C8.1 C9.1 C10.2 C11.1 C12.1 C13.1 C14.1 C15.1 C16.2 C17.1 C18.1 C19.1 C20.1 C21.1 C22.1 C23.1 C25.1 C27.1 R1.1 R2.1 R3.1 R4.1 R5.1 R6.1 R9.1 U1.A9(VSS1) U1.B1(VSSQ1) U1.B3(VSS2) U1.B9(VSSQ2) U1.D1(VSSQ3) U1.D8(VSSQ4) U1.E1(VSS3) U1.E2(VSSQ5) U1.E8(VSSQ6) U1.F9(VSSQ7) U1.G1(VSSQ8) U1.G8(VSS4) U1.G9(VSSQ9) U1.J2(VSS5) U1.J8(VSS6) U1.M1(VSS7) U1.M9(VSS8) U1.P1(VSS9) U1.P9(VSS10) U1.T1(VSS11) U1.T9(VSS12)
VDD_HIGH_CAP: C14.2 U2.N6(NVCC_DRAM_2P5)
DRAM_ADDR0: U1.N3(A0) U2.L5(DRAM_ADDR00)
DRAM_ADDR1: U1.P7(A1) U2.H2(DRAM_ADDR01)
DRAM_ADDR2: U1.P3(A2) U2.K1(DRAM_ADDR02)
DRAM_ADDR3: U1.N2(A3) U2.M2(DRAM_ADDR03)
DRAM_ADDR4: U1.P8(A4) U2.K4(DRAM_ADDR04)
DRAM_ADDR5: U1.P2(A5) U2.L1(DRAM_ADDR05)
DRAM_ADDR6: U1.R8(A6) U2.G2(DRAM_ADDR06)
DRAM_ADDR7: U1.R2(A7) U2.H4(DRAM_ADDR07)
DRAM_ADDR8: U1.T8(A8) U2.J4(DRAM_ADDR08)
DRAM_ADDR9: U1.R3(A9) U2.L2(DRAM_ADDR09)
DRAM_ADDR10: U1.L7(A10/AP) U2.M4(DRAM_ADDR10)
DRAM_ADDR11: U1.R7(A11) U2.K3(DRAM_ADDR11)
DRAM_ADDR12: U1.N7(A12/~{BC}) U2.L4(DRAM_ADDR12)
DRAM_ADDR13: U1.T3(A13) U2.H3(DRAM_ADDR13)
DRAM_ADDR14: U1.T7(A14) U2.G1(DRAM_ADDR14)
DRAM_ADDR15: U1.M7(NC_M7) U2.K5(DRAM_ADDR15)
DRAM_CAS_B: U1.K3(~{CAS}) U2.J2(~{DRAM_CAS})
DRAM_CS0_B: U1.L2(~{CS}) U2.N2(~{DRAM_CS0})
DRAM_CS1_B: U1.L1(NC_L1) U2.H5(~{DRAM_CS1})
DRAM_DATA0: U1.E3(DQ0) U2.T4(DRAM_DATA00)
DRAM_DATA1: U1.F7(DQ1) U2.U6(DRAM_DATA01)
DRAM_DATA2: U1.F2(DQ2) U2.T6(DRAM_DATA02)
DRAM_DATA3: U1.F8(DQ3) U2.U7(DRAM_DATA03)
DRAM_DATA4: U1.H3(DQ4) U2.U8(DRAM_DATA04)
DRAM_DATA5: U1.H8(DQ5) U2.T8(DRAM_DATA05)
DRAM_DATA6: U1.G2(DQ6) U2.T5(DRAM_DATA06)
DRAM_DATA7: U1.H7(DQ7) U2.U4(DRAM_DATA07)
DRAM_DATA8: U1.D7(DQ8) U2.U2(DRAM_DATA08)
DRAM_DATA9: U1.C3(DQ9) U2.U3(DRAM_DATA09)
DRAM_DATA10: U1.C8(DQ10) U2.U5(DRAM_DATA10)
DRAM_DATA11: U1.C2(DQ11) U2.R4(DRAM_DATA11)
DRAM_DATA12: U1.A7(DQ12) U2.P5(DRAM_DATA12)
DRAM_DATA13: U1.A2(DQ13) U2.P3(DRAM_DATA13)
DRAM_DATA14: U1.B8(DQ14) U2.R2(DRAM_DATA14)
DRAM_DATA15: U1.A3(DQ15) U2.R1(DRAM_DATA15)
DRAM_DQM0: U1.E7(LDM) U2.T7(DRAM_DQM0)
DRAM_DQM1: U1.D3(UDM) U2.T3(DRAM_DQM1)
DRAM_ODT0: U1.K1(ODT) U2.N1(DRAM_ODT0)
DRAM_ODT1: U1.J1(NC_J1) U2.F1(DRAM_ODT1)
DRAM_RAS_B: U1.J3(~{RAS}) U2.M5(~{DRAM_RAS})
DRAM_RESET_B: R5.2 U1.T2(~{RESET}) U2.G4(DRAM_RESET)
DRAM_SDBA0: U1.M2(BA0) U2.M1(DRAM_SDBA0)
DRAM_SDBA1: U1.N8(BA1) U2.H1(DRAM_SDBA1)
DRAM_SDBA2: U1.M3(BA2) U2.K2(DRAM_SDBA2)
DRAM_SDCKE0: R4.2 U1.K9(CKE) U2.M3(DRAM_SDCKE0)
DRAM_SDCKE1: R3.2 U1.J9(NC_J9) U2.J3(DRAM_SDCKE1)
DRAM_SDCLK0_N: R7.1 U1.K7(~{CK}) U2.P2(DRAM_SDCLK0_N)
DRAM_SDCLK0_P: R7.2 U1.J7(CK) U2.P1(DRAM_SDCLK0_P)
DRAM_SDQS0_N: C26.1 U1.G3(~{LDQS}) U2.P7(DRAM_SDQS0_N)
DRAM_SDQS0_P: C26.2 U1.F3(LDQS) U2.P6(DRAM_SDQS0_P)
DRAM_SDQS1_N: C28.1 U1.B7(~{UDQS}) U2.T2(DRAM_SDQS1_N)
DRAM_SDQS1_P: C28.2 U1.C7(UDQS) U2.T1(DRAM_SDQS1_P)
DRAM_SDWE_B: U1.L3(~{WE}) U2.J1(~{DRAM_SDWE})
DRAM_VREF: C7.1 C10.1 C15.2 C24.1 C27.2 R8.1 R9.2 U1.H1(VREFDQ) U1.M8(VREFCA) U2.P4(DRAM_VREF)
DRAM_ZQ0: R1.2 U1.L8(ZQ)
DRAM_ZQ1: R2.2 U1.L9(NC_L9)
ZQPAD: R6.2 U2.N4(DRAM_ZQPAD)

### Layout directives
differential pair: DRAM_SDCLK0_N, DRAM_SDCLK0_P, DRAM_SDQS0_N, DRAM_SDQS0_P, DRAM_SDQS1_N, DRAM_SDQS1_P

### Notes on the sheet
- DDR电路
- DDR 差分 100欧姆
- DDR布线规范
- DDR需要分组等长处理 (电源、数据总线、其他)
- 数据线低八位 = (d0-d7、dqm0、dqs0_p/n)
- 数据线高八位 = (d8-d15、dqm1、dqs1_p/n)
- 其余分为一组等长处理
- (in symbol MCIMX6Y2CVM0xAB, part B) I.MX6ULL-DDR

### Library data of the parts
C1-C15 C18-C28 = 0402_C: 贴片电容; ComponentLink1Description: 供应商链接; ComponentLink1URL: http://www.szlcsc.com/product/details_1928.html; Package: 0402; Supplier: LC; SuppliersPartNumber: C1576
C16 C17 = 0603_C_MINI: 贴片电容; ComponentLink1Description: 供应商链接; ComponentLink1URL: http://www.szlcsc.com/product/details_2037.html; Package: 0603; Supplier: LC; SuppliersPartNumber: C1685
R1-R9 = 0402_R: 贴片电阻; ComponentLink1Description: 供应商链接; ComponentLink1URL: http://www.szlcsc.com/product/details_26667.html; Package: 0402; Supplier: LC; SuppliersPartNumber: C25924

## Sheet Connector.SchDoc
size 203 x 193 mm
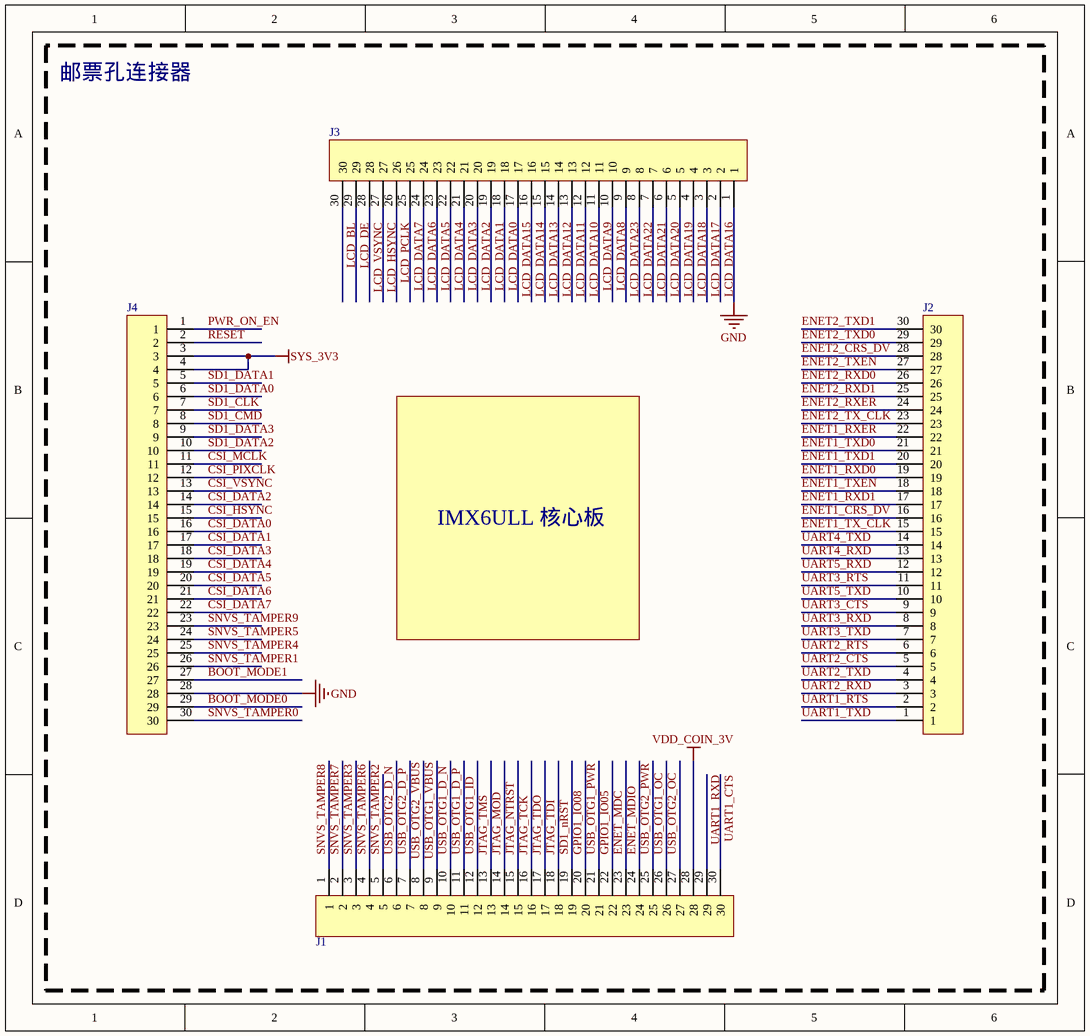
[diagram p3: Connector.SchDoc]

### Parts
J1  stamp_hole_30  [STAMP_HOLE_30]  (value not drawn)
J2  stamp_hole_30  [STAMP_HOLE_30]  (value not drawn)
J3  stamp_hole_30  [STAMP_HOLE_30]  (value not drawn)
J4  stamp_hole_30  [STAMP_HOLE_30]  (value not drawn)

### Nets
GND: J3.1 J4.28
SYS_3V3: J4.3 J4.4
USB_OTG1_VBUS: J1.9
USB_OTG2_VBUS: J1.8
VDD_COIN_3V: J1.28
BOOT_MODE0: J4.29
BOOT_MODE1: J4.27
CSI_DATA0: J4.16
CSI_DATA1: J4.17
CSI_DATA2: J4.14
CSI_DATA3: J4.18
CSI_DATA4: J4.19
CSI_DATA5: J4.20
CSI_DATA6: J4.21
CSI_DATA7: J4.22
CSI_HSYNC: J4.15
CSI_MCLK: J4.11
CSI_PIXCLK: J4.12
CSI_VSYNC: J4.13
ENET1_CRS_DV: J2.16
ENET1_RXD0: J2.19
ENET1_RXD1: J2.17
ENET1_RXER: J2.22
ENET1_TX_CLK: J2.15
ENET1_TXD0: J2.21
ENET1_TXD1: J2.20
ENET1_TXEN: J2.18
ENET2_CRS_DV: J2.28
ENET2_RXD0: J2.26
ENET2_RXD1: J2.25
ENET2_RXER: J2.24
ENET2_TX_CLK: J2.23
ENET2_TXD0: J2.29
ENET2_TXD1: J2.30
ENET2_TXEN: J2.27
ENET_MDC: J1.23
ENET_MDIO: J1.24
GPIO1_IO05: J1.22
GPIO1_IO08: J1.20
JTAG_MOD: J1.14
JTAG_nTRST: J1.15
JTAG_TCK: J1.16
JTAG_TDI: J1.18
JTAG_TDO: J1.17
JTAG_TMS: J1.13
LCD_BL: J3.30
LCD_DATA0: J3.18
LCD_DATA1: J3.19
LCD_DATA2: J3.20
LCD_DATA3: J3.21
LCD_DATA4: J3.22
LCD_DATA5: J3.23
LCD_DATA6: J3.24
LCD_DATA7: J3.25
LCD_DATA8: J3.10
LCD_DATA9: J3.11
LCD_DATA10: J3.12
LCD_DATA11: J3.13
LCD_DATA12: J3.14
LCD_DATA13: J3.15
LCD_DATA14: J3.16
LCD_DATA15: J3.17
LCD_DATA16: J3.2
LCD_DATA17: J3.3
LCD_DATA18: J3.4
LCD_DATA19: J3.5
LCD_DATA20: J3.6
LCD_DATA21: J3.7
LCD_DATA22: J3.8
LCD_DATA23: J3.9
LCD_DE: J3.29
LCD_HSYNC: J3.27
LCD_PCLK: J3.26
LCD_VSYNC: J3.28
PWR_ON_EN: J4.1
RESET: J4.2
SD1_CLK: J4.7
SD1_CMD: J4.8
SD1_DATA0: J4.6
SD1_DATA1: J4.5
SD1_DATA2: J4.10
SD1_DATA3: J4.9
SD1_nRST: J1.19
SNVS_TAMPER0: J4.30
SNVS_TAMPER1: J4.26
SNVS_TAMPER2: J1.5
SNVS_TAMPER3: J1.3
SNVS_TAMPER4: J4.25
SNVS_TAMPER5: J4.24
SNVS_TAMPER6: J1.4
SNVS_TAMPER7: J1.2
SNVS_TAMPER8: J1.1
SNVS_TAMPER9: J4.23
UART1_CTS: J1.30
UART1_RTS: J2.2
UART1_RXD: J1.29
UART1_TXD: J2.1
UART2_CTS: J2.5
UART2_RTS: J2.6
UART2_RXD: J2.3
UART2_TXD: J2.4
UART3_CTS: J2.9
UART3_RTS: J2.11
UART3_RXD: J2.8
UART3_TXD: J2.7
UART4_RXD: J2.13
UART4_TXD: J2.14
UART5_RXD: J2.12
UART5_TXD: J2.10
USB_OTG1_D_N: J1.10
USB_OTG1_D_P: J1.11
USB_OTG1_ID: J1.12
USB_OTG1_OC: J1.26
USB_OTG1_PWR: J1.21
USB_OTG2_D_N: J1.6
USB_OTG2_D_P: J1.7
USB_OTG2_OC: J1.27
USB_OTG2_PWR: J1.25

### Notes on the sheet
- 邮票孔连接器
- IMX6ULL 核心板

## Sheet eMMC.SchDoc
size 203 x 241 mm; SheetNumber: 4; SheetTotal: 4
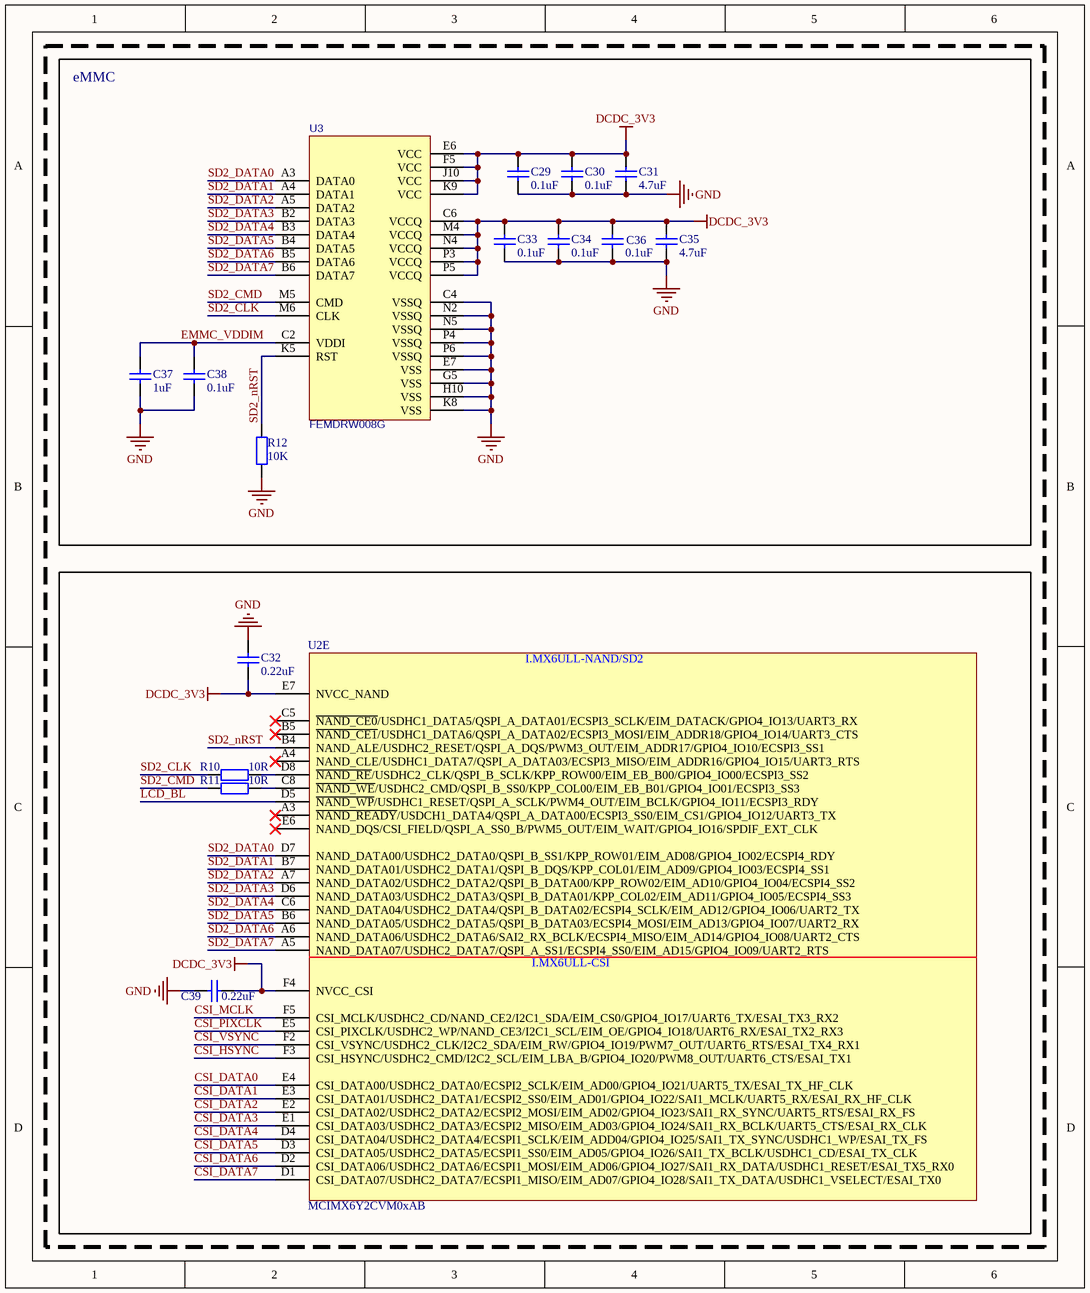
[diagram p4: eMMC.SchDoc]

### Parts
C29  0.1uF  [0402_C]
C30  0.1uF  [0402_C]
C31  4.7uF  [0402_C]
C32  0.22uF  [0402_C]
C33  0.1uF  [0402_C]
C34  0.1uF  [0402_C]
C35  4.7uF  [0402_C]
C36  0.1uF  [0402_C]
C37  1uF  [0402_C]
C38  0.1uF  [0402_C]
C39  0.22uF  [0402_C]
R10  10R  [0402_R]
R11  10R  [0402_R]
R12  10K  [0402_R]
U2  MCIMX6Y2CVM0xAB  [BGA289_17x17_0.8Pitch]  (part E of 5)
U3  FEMDRW008G  [BGA169  EMMC]

### Blocks framed on the sheet
eMMC: C29-C31 C33-C38 R12 U3

### Nets
DCDC_3V3: C29.2 C30.2 C31.2 C32.1 C33.2 C34.2 C35.2 C36.2 C39.1 U2.E7(NVCC_NAND) U2.F4(NVCC_CSI) U3.C6(VCCQ) U3.E6(VCC) U3.F5(VCC) U3.J10(VCC) U3.K9(VCC) U3.M4(VCCQ) U3.N4(VCCQ) U3.P3(VCCQ) U3.P5(VCCQ)
GND: C29.1 C30.1 C31.1 C32.2 C33.1 C34.1 C35.1 C36.1 C37.1 C38.1 C39.2 R12.1 U3.C4(VSSQ) U3.E7(VSS) U3.G5(VSS) U3.H10(VSS) U3.K8(VSS) U3.N2(VSSQ) U3.N5(VSSQ) U3.P4(VSSQ) U3.P6(VSSQ)
CSI_DATA0: U2.E4(CSI_DATA00/USDHC2_DATA0/ECSPI2_SCLK/EIM_AD00/GPIO4_IO21/UART5_TX/ESAI_TX_HF_CLK)
CSI_DATA1: U2.E3(CSI_DATA01/USDHC2_DATA1/ECSPI2_SS0/EIM_AD01/GPIO4_IO22/SAI1_MCLK/UART5_RX/ESAI_RX_HF_CLK)
CSI_DATA2: U2.E2(CSI_DATA02/USDHC2_DATA2/ECSPI2_MOSI/EIM_AD02/GPIO4_IO23/SAI1_RX_SYNC/UART5_RTS/ESAI_RX_FS)
CSI_DATA3: U2.E1(CSI_DATA03/USDHC2_DATA3/ECSPI2_MISO/EIM_AD03/GPIO4_IO24/SAI1_RX_BCLK/UART5_CTS/ESAI_RX_CLK)
CSI_DATA4: U2.D4(CSI_DATA04/USDHC2_DATA4/ECSPI1_SCLK/EIM_ADD04/GPIO4_IO25/SAI1_TX_SYNC/USDHC1_WP/ESAI_TX_FS)
CSI_DATA5: U2.D3(CSI_DATA05/USDHC2_DATA5/ECSPI1_SS0/EIM_AD05/GPIO4_IO26/SAI1_TX_BCLK/USDHC1_CD/ESAI_TX_CLK)
CSI_DATA6: U2.D2(CSI_DATA06/USDHC2_DATA6/ECSPI1_MOSI/EIM_AD06/GPIO4_IO27/SAI1_RX_DATA/USDHC1_RESET/ESAI_TX5_RX0)
CSI_DATA7: U2.D1(CSI_DATA07/USDHC2_DATA7/ECSPI1_MISO/EIM_AD07/GPIO4_IO28/SAI1_TX_DATA/USDHC1_VSELECT/ESAI_TX0)
CSI_HSYNC: U2.F3(CSI_HSYNC/USDHC2_CMD/I2C2_SCL/EIM_LBA_B/GPIO4_IO20/PWM8_OUT/UART6_CTS/ESAI_TX1)
CSI_MCLK: U2.F5(CSI_MCLK/USDHC2_CD/NAND_CE2/I2C1_SDA/EIM_CS0/GPIO4_IO17/UART6_TX/ESAI_TX3_RX2)
CSI_PIXCLK: U2.E5(CSI_PIXCLK/USDHC2_WP/NAND_CE3/I2C1_SCL/EIM_OE/GPIO4_IO18/UART6_RX/ESAI_TX2_RX3)
CSI_VSYNC: U2.F2(CSI_VSYNC/USDHC2_CLK/I2C2_SDA/EIM_RW/GPIO4_IO19/PWM7_OUT/UART6_RTS/ESAI_TX4_RX1)
EMMC_VDDIM: C37.2 C38.2 U3.C2(VDDI)
LCD_BL: U2.D5(~{NAND_WP}/USDHC1_RESET/QSPI_A_SCLK/PWM4_OUT/EIM_BCLK/GPIO4_IO11/ECSPI3_RDY)
SD2_CLK: R10.1 U3.M6(CLK)
SD2_CMD: R11.1 U3.M5(CMD)
SD2_DATA0: U2.D7(NAND_DATA00/USDHC2_DATA0/QSPI_B_SS1/KPP_ROW01/EIM_AD08/GPIO4_IO02/ECSPI4_RDY) U3.A3(DATA0)
SD2_DATA1: U2.B7(NAND_DATA01/USDHC2_DATA1/QSPI_B_DQS/KPP_COL01/EIM_AD09/GPIO4_IO03/ECSPI4_SS1) U3.A4(DATA1)
SD2_DATA2: U2.A7(NAND_DATA02/USDHC2_DATA2/QSPI_B_DATA00/KPP_ROW02/EIM_AD10/GPIO4_IO04/ECSPI4_SS2) U3.A5(DATA2)
SD2_DATA3: U2.D6(NAND_DATA03/USDHC2_DATA3/QSPI_B_DATA01/KPP_COL02/EIM_AD11/GPIO4_IO05/ECSPI4_SS3) U3.B2(DATA3)
SD2_DATA4: U2.C6(NAND_DATA04/USDHC2_DATA4/QSPI_B_DATA02/ECSPI4_SCLK/EIM_AD12/GPIO4_IO06/UART2_TX) U3.B3(DATA4)
SD2_DATA5: U2.B6(NAND_DATA05/USDHC2_DATA5/QSPI_B_DATA03/ECSPI4_MOSI/EIM_AD13/GPIO4_IO07/UART2_RX) U3.B4(DATA5)
SD2_DATA6: U2.A6(NAND_DATA06/USDHC2_DATA6/SAI2_RX_BCLK/ECSPI4_MISO/EIM_AD14/GPIO4_IO08/UART2_CTS) U3.B5(DATA6)
SD2_DATA7: U2.A5(NAND_DATA07/USDHC2_DATA7/QSPI_A_SS1/ECSPI4_SS0/EIM_AD15/GPIO4_IO09/UART2_RTS) U3.B6(DATA7)
SD2_nRST: R12.2 U2.B4(NAND_ALE/USDHC2_RESET/QSPI_A_DQS/PWM3_OUT/EIM_ADDR17/GPIO4_IO10/ECSPI3_SS1) U3.K5(RST)
NetR10_2: R10.2 U2.D8(~{NAND_RE}/USDHC2_CLK/QSPI_B_SCLK/KPP_ROW00/EIM_EB_B00/GPIO4_IO00/ECSPI3_SS2)
NetR11_2: R11.2 U2.C8(~{NAND_WE}/USDHC2_CMD/QSPI_B_SS0/KPP_COL00/EIM_EB_B01/GPIO4_IO01/ECSPI3_SS3)

Not connected (* = marked no-connect by the designer): U2 A3(~{NAND_READY}/USDCH1_DATA4/QSPI_A_DATA00/ECSPI3_SS0/EIM_CS1/GPIO4_IO12/UART3_TX)* A4(NAND_CLE/USDHC1_DATA7/QSPI_A_DATA03/ECSPI3_MISO/EIM_ADDR16/GPIO4_IO15/UART3_RTS)* B5(~{NAND_CE1}/USDHC1_DATA6/QSPI_A_DATA02/ECSPI3_MOSI/EIM_ADDR18/GPIO4_IO14/UART3_CTS)* C5(~{NAND_CE0}/USDHC1_DATA5/QSPI_A_DATA01/ECSPI3_SCLK/EIM_DATACK/GPIO4_IO13/UART3_RX)* E6(NAND_DQS/CSI_FIELD/QSPI_A_SS0_B/PWM5_OUT/EIM_WAIT/GPIO4_IO16/SPDIF_EXT_CLK)*

### Notes on the sheet
- (in symbol MCIMX6Y2CVM0xAB, part E) I.MX6ULL-NAND/SD2; I.MX6ULL-CSI

### Library data of the parts
C29-C39 = 0402_C: 贴片电容; ComponentLink1Description: 供应商链接; ComponentLink1URL: http://www.szlcsc.com/product/details_1928.html; Package: 0402; Supplier: LC; SuppliersPartNumber: C1576
R10-R12 = 0402_R: 贴片电阻; ComponentLink1Description: 供应商链接; ComponentLink1URL: http://www.szlcsc.com/product/details_26667.html; Package: 0402; Supplier: LC; SuppliersPartNumber: C25924
U3 = FEMDRW008G: BOM_Manufacturer: Samsung; BOM_Manufacturer Part: KLM8G1GETF-B041; Contributor: LCSC; BOM_Supplier: LCSC; BOM_Supplier Part: C499918; BOM_JLCPCB Part Class: Extended Part; spicePre: U; spiceSymbolName: KLM8G1GETF-B041

## Nets that join several sheets
DCDC_3V3: Power (16 pins), Imx6ull (16 pins), eMMC (20 pins)
DRAM_1V35: Power (R27.2), DDR (46 pins)
GND: Power (89 pins), Imx6ull (22 pins), DDR (53 pins), Connector (J3.1 J4.28), eMMC (21 pins)
SYS_3V3: Power (C65.2 R35.1 U4.5 U5.4), Connector (J4.3 J4.4)
USB_OTG1_VBUS: Imx6ull (C45.2 U2.T12), Connector (J1.9)
USB_OTG2_VBUS: Imx6ull (C48.2 U2.U12), Connector (J1.8)
VDD_COIN_3V: Power (D4.1 R30.1), Connector (J1.28)
VDD_HIGH_CAP: Power (C76.2 C77.2 U2.R14 U2.R15), DDR (C14.2 U2.N6)
BOOT_MODE0: Imx6ull (U2.T10), Connector (J4.29)
BOOT_MODE1: Imx6ull (U2.U10), Connector (J4.27)
CSI_DATA0: Connector (J4.16), eMMC (U2.E4)
CSI_DATA1: Connector (J4.17), eMMC (U2.E3)
CSI_DATA2: Connector (J4.14), eMMC (U2.E2)
CSI_DATA3: Connector (J4.18), eMMC (U2.E1)
CSI_DATA4: Connector (J4.19), eMMC (U2.D4)
CSI_DATA5: Connector (J4.20), eMMC (U2.D3)
CSI_DATA6: Connector (J4.21), eMMC (U2.D2)
CSI_DATA7: Connector (J4.22), eMMC (U2.D1)
CSI_HSYNC: Connector (J4.15), eMMC (U2.F3)
CSI_MCLK: Connector (J4.11), eMMC (U2.F5)
CSI_PIXCLK: Connector (J4.12), eMMC (U2.E5)
CSI_VSYNC: Connector (J4.13), eMMC (U2.F2)
ENET1_CRS_DV: Imx6ull (U2.E16), Connector (J2.16)
ENET1_RXD0: Imx6ull (U2.F16), Connector (J2.19)
ENET1_RXD1: Imx6ull (U2.E17), Connector (J2.17)
ENET1_RXER: Imx6ull (U2.D15), Connector (J2.22)
ENET1_TX_CLK: Imx6ull (C53.1 R19.2), Connector (J2.15)
ENET1_TXD0: Imx6ull (U2.E15), Connector (J2.21)
ENET1_TXD1: Imx6ull (U2.E14), Connector (J2.20)
ENET1_TXEN: Imx6ull (U2.F15), Connector (J2.18)
ENET2_CRS_DV: Imx6ull (U2.B17), Connector (J2.28)
ENET2_RXD0: Imx6ull (U2.C17), Connector (J2.26)
ENET2_RXD1: Imx6ull (U2.C16), Connector (J2.25)
ENET2_RXER: Imx6ull (U2.D16), Connector (J2.24)
ENET2_TX_CLK: Imx6ull (C57.2 R20.2), Connector (J2.23)
ENET2_TXD0: Imx6ull (U2.A15), Connector (J2.29)
ENET2_TXD1: Imx6ull (U2.A16), Connector (J2.30)
ENET2_TXEN: Imx6ull (U2.B15), Connector (J2.27)
ENET_MDC: Imx6ull (U2.L16), Connector (J1.23)
ENET_MDIO: Imx6ull (U2.K17), Connector (J1.24)
GPIO1_IO05: Imx6ull (U2.M17), Connector (J1.22)
GPIO1_IO08: Imx6ull (U2.N17), Connector (J1.20)
JTAG_MOD: Imx6ull (R13.1 U2.P15), Connector (J1.14)
JTAG_nTRST: Imx6ull (U2.N14), Connector (J1.15)
JTAG_TCK: Imx6ull (U2.M14), Connector (J1.16)
JTAG_TDI: Imx6ull (U2.N16), Connector (J1.18)
JTAG_TDO: Imx6ull (U2.N15), Connector (J1.17)
JTAG_TMS: Imx6ull (U2.P14), Connector (J1.13)
LCD_BL: Connector (J3.30), eMMC (U2.D5)
LCD_DATA0: Imx6ull (U2.B9), Connector (J3.18)
LCD_DATA1: Imx6ull (U2.A9), Connector (J3.19)
LCD_DATA2: Imx6ull (U2.E10), Connector (J3.20)
LCD_DATA3: Imx6ull (U2.D10), Connector (J3.21)
LCD_DATA4: Imx6ull (U2.C10), Connector (J3.22)
LCD_DATA5: Imx6ull (U2.B10), Connector (J3.23)
LCD_DATA6: Imx6ull (U2.A10), Connector (J3.24)
LCD_DATA7: Imx6ull (U2.D11), Connector (J3.25)
LCD_DATA8: Imx6ull (U2.B11), Connector (J3.10)
LCD_DATA9: Imx6ull (U2.A11), Connector (J3.11)
LCD_DATA10: Imx6ull (U2.E12), Connector (J3.12)
LCD_DATA11: Imx6ull (U2.D12), Connector (J3.13)
LCD_DATA12: Imx6ull (U2.C12), Connector (J3.14)
LCD_DATA13: Imx6ull (U2.B12), Connector (J3.15)
LCD_DATA14: Imx6ull (U2.A12), Connector (J3.16)
LCD_DATA15: Imx6ull (U2.D13), Connector (J3.17)
LCD_DATA16: Imx6ull (U2.C13), Connector (J3.2)
LCD_DATA17: Imx6ull (U2.B13), Connector (J3.3)
LCD_DATA18: Imx6ull (U2.A13), Connector (J3.4)
LCD_DATA19: Imx6ull (U2.D14), Connector (J3.5)
LCD_DATA20: Imx6ull (U2.C14), Connector (J3.6)
LCD_DATA21: Imx6ull (U2.B14), Connector (J3.7)
LCD_DATA22: Imx6ull (U2.A14), Connector (J3.8)
LCD_DATA23: Imx6ull (U2.B16), Connector (J3.9)
LCD_DE: Imx6ull (U2.B8), Connector (J3.29)
LCD_HSYNC: Imx6ull (U2.D9), Connector (J3.27)
LCD_PCLK: Imx6ull (R18.1), Connector (J3.26)
LCD_VSYNC: Imx6ull (U2.C9), Connector (J3.28)
nWDOG: Power (R26.2), Imx6ull (U2.E9)
PMIC_ON_REQ: Power (R22.1), Imx6ull (U2.T9)
PWR_ON_EN: Power (R21.2), Connector (J4.1)
RESET: Power (R25.2), Connector (J4.2)
SD1_CLK: Imx6ull (C50.2 R15.1), Connector (J4.7)
SD1_CMD: Imx6ull (R16.2 U2.C2), Connector (J4.8)
SD1_DATA0: Imx6ull (R17.2 U2.B3), Connector (J4.6)
SD1_DATA1: Imx6ull (U2.B2), Connector (J4.5)
SD1_DATA2: Imx6ull (U2.B1), Connector (J4.10)
SD1_DATA3: Imx6ull (U2.A2), Connector (J4.9)
SD1_nRST: Imx6ull (U2.M15), Connector (J1.19)
SNVS_TAMPER0: Imx6ull (U2.R10), Connector (J4.30)
SNVS_TAMPER1: Imx6ull (U2.R9), Connector (J4.26)
SNVS_TAMPER2: Imx6ull (U2.P11), Connector (J1.5)
SNVS_TAMPER3: Imx6ull (U2.P10), Connector (J1.3)
SNVS_TAMPER4: Imx6ull (U2.P9), Connector (J4.25)
SNVS_TAMPER5: Imx6ull (U2.N8), Connector (J4.24)
SNVS_TAMPER6: Imx6ull (U2.N11), Connector (J1.4)
SNVS_TAMPER7: Imx6ull (U2.N10), Connector (J1.2)
SNVS_TAMPER8: Imx6ull (U2.N9), Connector (J1.1)
SNVS_TAMPER9: Imx6ull (U2.R6), Connector (J4.23)
UART1_CTS: Imx6ull (U2.K15), Connector (J1.30)
UART1_RTS: Imx6ull (U2.J14), Connector (J2.2)
UART1_RXD: Imx6ull (U2.K16), Connector (J1.29)
UART1_TXD: Imx6ull (U2.K14), Connector (J2.1)
UART2_CTS: Imx6ull (U2.J15), Connector (J2.5)
UART2_RTS: Imx6ull (U2.H14), Connector (J2.6)
UART2_RXD: Imx6ull (U2.J16), Connector (J2.3)
UART2_TXD: Imx6ull (U2.J17), Connector (J2.4)
UART3_CTS: Imx6ull (U2.H15), Connector (J2.9)
UART3_RTS: Imx6ull (U2.G14), Connector (J2.11)
UART3_RXD: Imx6ull (U2.H16), Connector (J2.8)
UART3_TXD: Imx6ull (U2.H17), Connector (J2.7)
UART4_RXD: Imx6ull (U2.G16), Connector (J2.13)
UART4_TXD: Imx6ull (U2.G17), Connector (J2.14)
UART5_RXD: Imx6ull (U2.G13), Connector (J2.12)
UART5_TXD: Imx6ull (U2.F17), Connector (J2.10)
USB_OTG1_D_N: Imx6ull (U2.T15), Connector (J1.10)
USB_OTG1_D_P: Imx6ull (U2.U15), Connector (J1.11)
USB_OTG1_ID: Imx6ull (U2.K13), Connector (J1.12)
USB_OTG1_OC: Imx6ull (U2.L15), Connector (J1.26)
USB_OTG1_PWR: Imx6ull (U2.M16), Connector (J1.21)
USB_OTG2_D_N: Imx6ull (U2.T13), Connector (J1.6)
USB_OTG2_D_P: Imx6ull (U2.U13), Connector (J1.7)
USB_OTG2_OC: Imx6ull (U2.L17), Connector (J1.27)
USB_OTG2_PWR: Imx6ull (U2.L14), Connector (J1.25)